# EAGLE design board (EAGLE 9.6.2)
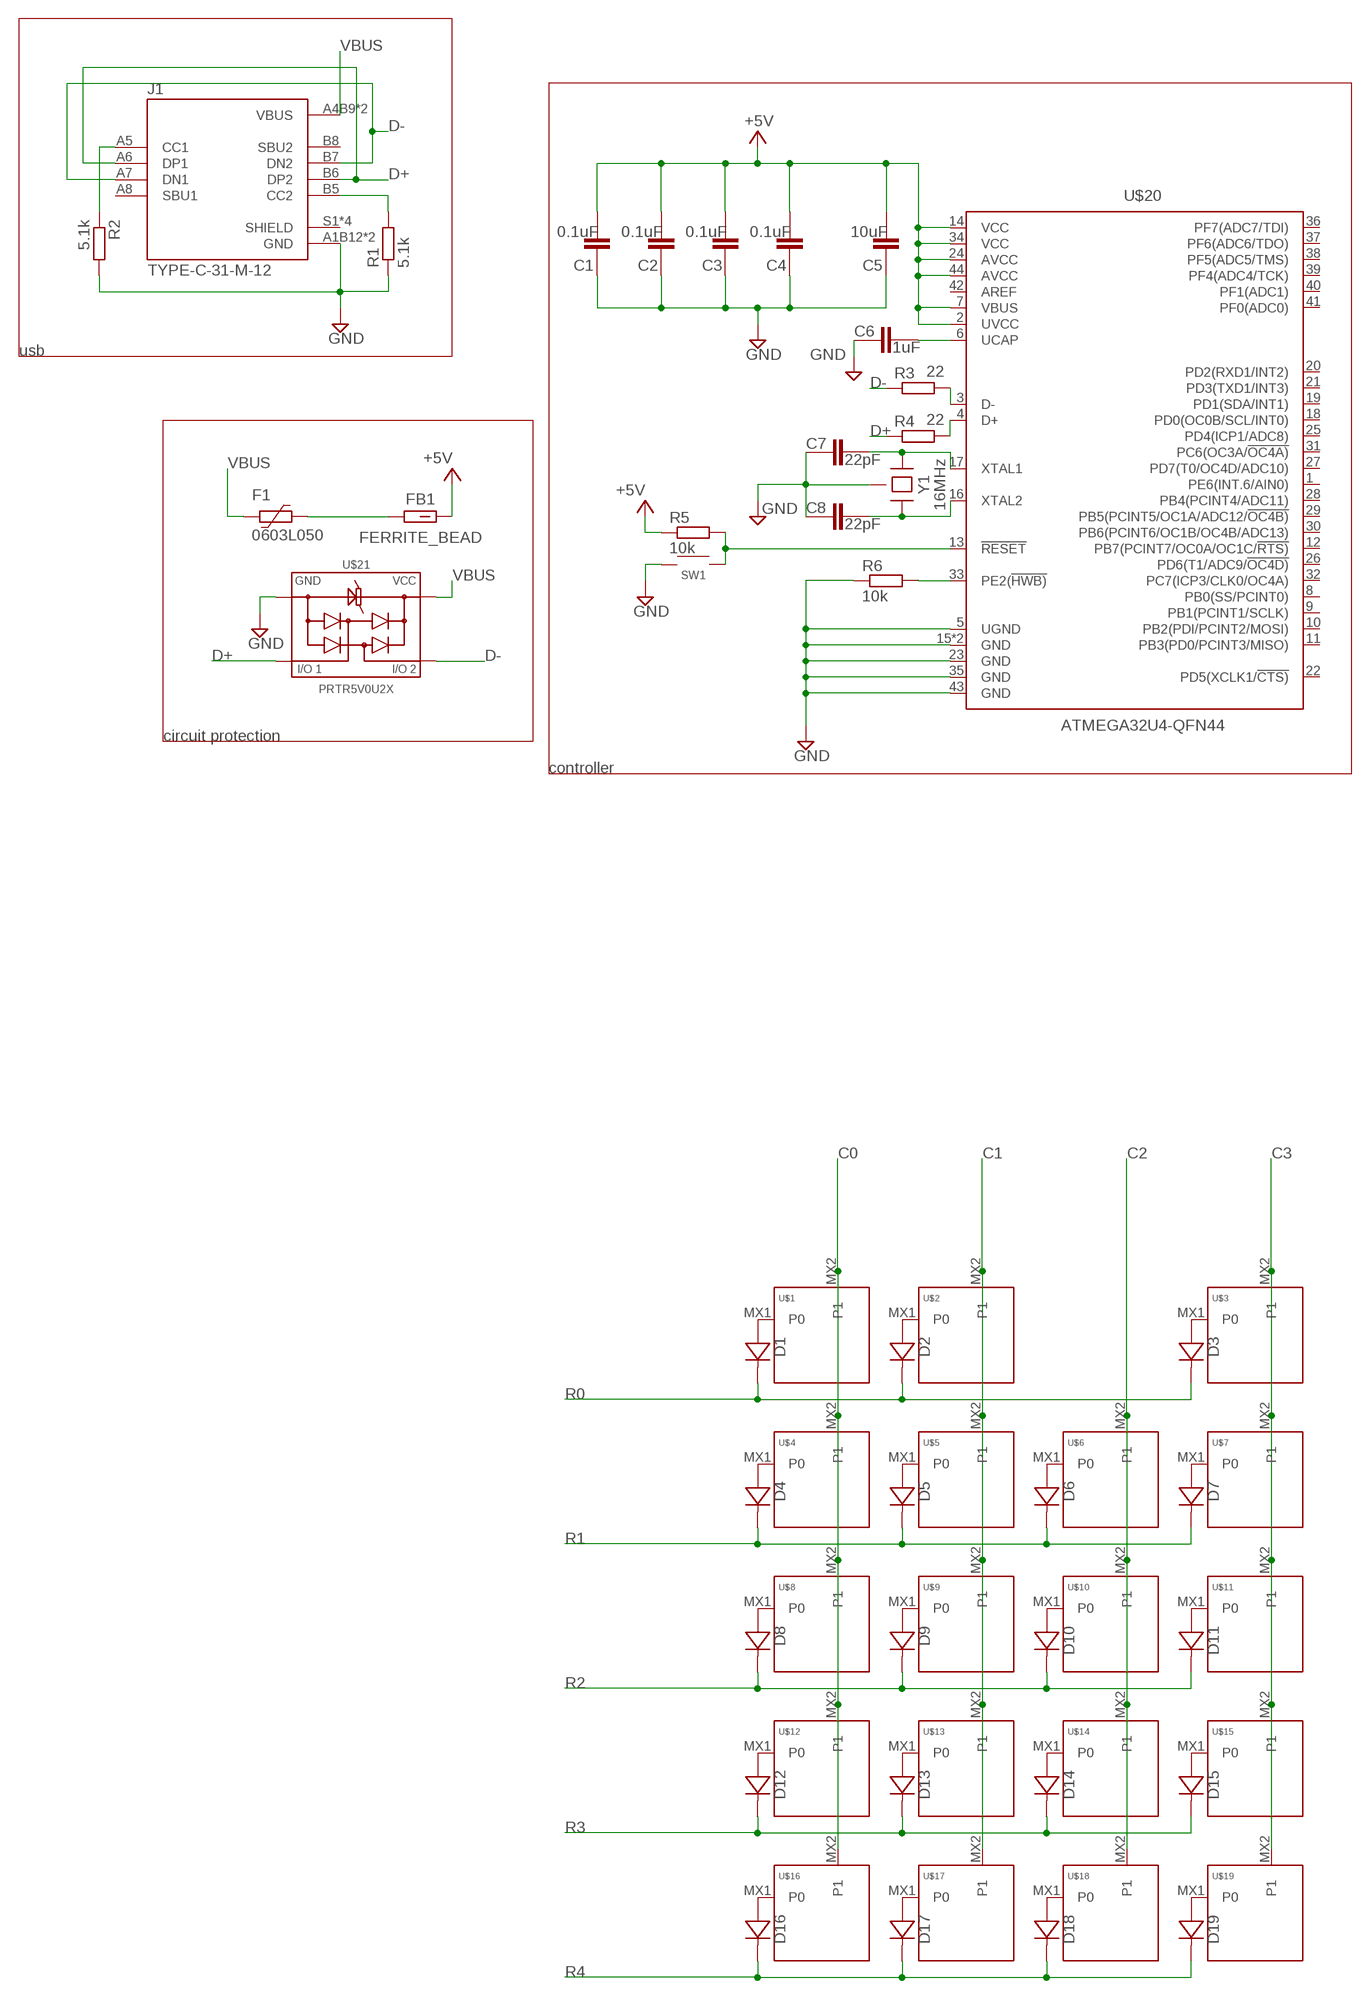
[diagram p0: schematic, sheet 1]

## Parts
C1  0.1uF  CAPACITOR-0603  [C0603]
C2  0.1uF  CAPACITOR-0603  [C0603]
C3  0.1uF  CAPACITOR-0603  [C0603]
C4  0.1uF  CAPACITOR-0603  [C0603]
C5  10uF  CAPACITOR-0603  [C0603]
C6  1uF  CAPACITOR-0603  [C0603]
C7  22pF  CAPACITOR-0603  [C0603]
C8  22pF  CAPACITOR-0603  [C0603]
D1  DIODE-SOD-123  [SOD-123]
D2  DIODE-SOD-123  [SOD-123]
D3  DIODE-SOD-123  [SOD-123]
D4  DIODE-SOD-123  [SOD-123]
D5  DIODE-SOD-123  [SOD-123]
D6  DIODE-SOD-123  [SOD-123]
D7  DIODE-SOD-123  [SOD-123]
D8  DIODE-SOD-123  [SOD-123]
D9  DIODE-SOD-123  [SOD-123]
D10  DIODE-SOD-123  [SOD-123]
D11  DIODE-SOD-123  [SOD-123]
D12  DIODE-SOD-123  [SOD-123]
D13  DIODE-SOD-123  [SOD-123]
D14  DIODE-SOD-123  [SOD-123]
D15  DIODE-SOD-123  [SOD-123]
D16  DIODE-SOD-123  [SOD-123]
D17  DIODE-SOD-123  [SOD-123]
D18  DIODE-SOD-123  [SOD-123]
D19  DIODE-SOD-123  [SOD-123]
F1  0603L050  [0603L]
FB1  FERRITE_BEAD  FBCHIP-0603(1608-METRIC)  [BEADC1608X95N]
J1  TYPE-C-31-M-12  [HRO_TYPE-C-31-M-12]
R1  5.1k  RESISTOR-0603  [R0603]
R2  5.1k  RESISTOR-0603  [R0603]
R3  22  RESISTOR-0603  [R0603]
R4  22  RESISTOR-0603  [R0603]
R5  10k  RESISTOR-0603  [R0603]
R6  10k  RESISTOR-0603  [R0603]
SW1  SWITCH-SMD-EVP-BB2A9B00  [SWITCH-SMD-EVP-BB2A9B00]
U$1  KEYSWITCH-PLAIN-MX-1U  [MX-1U]
U$2  KEYSWITCH-PLAIN-MX-2U-FLIPPED  [MX-2U-FLIPPED]
U$3  KEYSWITCH-PLAIN-MX-1U  [MX-1U]
U$4  KEYSWITCH-PLAIN-MX-1U  [MX-1U]
U$5  KEYSWITCH-PLAIN-MX-1U  [MX-1U]
U$6  KEYSWITCH-PLAIN-MX-1U  [MX-1U]
U$7  KEYSWITCH-PLAIN-MX-1U  [MX-1U]
U$8  KEYSWITCH-PLAIN-MX-1U  [MX-1U]
U$9  KEYSWITCH-PLAIN-MX-1U  [MX-1U]
U$10  KEYSWITCH-PLAIN-MX-1U  [MX-1U]
U$11  KEYSWITCH-PLAIN-MX-1U  [MX-1U]
U$12  KEYSWITCH-PLAIN-MX-1U  [MX-1U]
U$13  KEYSWITCH-PLAIN-MX-1U  [MX-1U]
U$14  KEYSWITCH-PLAIN-MX-1U  [MX-1U]
U$15  KEYSWITCH-PLAIN-MX-1U  [MX-1U]
U$16  KEYSWITCH-PLAIN-MX-1U  [MX-1U]
U$17  KEYSWITCH-PLAIN-MX-1U  [MX-1U]
U$18  KEYSWITCH-PLAIN-MX-1U  [MX-1U]
U$19  KEYSWITCH-PLAIN-MX-1U  [MX-1U]
U$20  ATMEGA32U4-QFN44  [QFN-44]
U$21  PRTR5V0U2X  [PRTR5V0U2X]
Y1  16MHz  CRYSTAL-4PIN-3.2X2.5  [CRYSTAL-3.2X2.5]

## Nets
C0: U$1.MX2(P1) U$4.MX2(P1) U$8.MX2(P1) U$12.MX2(P1) U$16.MX2(P1)
C1: U$2.MX2(P1) U$5.MX2(P1) U$9.MX2(P1) U$13.MX2(P1) U$17.MX2(P1)
C2: U$6.MX2(P1) U$10.MX2(P1) U$14.MX2(P1) U$18.MX2(P1)
C3: U$3.MX2(P1) U$7.MX2(P1) U$11.MX2(P1) U$15.MX2(P1) U$19.MX2(P1)
D+: J1.A6(DP1) J1.B6(DP2) R4.1 U$21.2
D-: J1.A7(DN1) J1.B7(DN2) R3.1 U$21.3
GND: C1.1 C2.1 C3.1 C4.1 C5.1 C6.1 C7.1 C8.1 J1.A1B12(GND) J1.B1A12(GND) R1.1 R2.2 R6.1 SW1.A@1 SW1.A@2 U$20.5(UGND) U$20.15(GND) U$20.23(GND) U$20.35(GND) U$20.43(GND) U$20.TAB(GND) U$21.1 Y1.2(GND) Y1.4(GND)
N$1: D1.A U$1.MX1(P0)
N$2: D2.A U$2.MX1(P0)
N$3: D3.A U$3.MX1(P0)
N$4: D4.A U$4.MX1(P0)
N$5: D5.A U$5.MX1(P0)
N$6: D6.A U$6.MX1(P0)
N$7: D7.A U$7.MX1(P0)
N$8: D8.A U$8.MX1(P0)
N$9: D9.A U$9.MX1(P0)
N$10: D10.A U$10.MX1(P0)
N$11: D11.A U$11.MX1(P0)
N$12: D12.A U$12.MX1(P0)
N$13: D13.A U$13.MX1(P0)
N$14: D14.A U$14.MX1(P0)
N$15: D15.A U$15.MX1(P0)
N$16: D16.A U$16.MX1(P0)
N$17: D17.A U$17.MX1(P0)
N$18: D18.A U$18.MX1(P0)
N$19: D19.A U$19.MX1(P0)
N$20: J1.A5(CC1) R2.1
N$21: C6.2 U$20.6(UCAP)
N$22: C7.2 U$20.17(XTAL1) Y1.1
N$23: J1.B5(CC2) R1.2
N$24: R3.2 U$20.3(D-)
N$25: R4.2 U$20.4(D+)
N$26: C8.2 U$20.16(XTAL2) Y1.3
N$27: R5.2 SW1.B@3 SW1.B@4 U$20.13(!RESET)
N$28: R6.2 U$20.33(PE2(!HWB))
N$29: F1.1 FB1.1
R0: D1.C D2.C D3.C
R1: D4.C D5.C D6.C D7.C
R2: D8.C D9.C D10.C D11.C
R3: D12.C D13.C D14.C D15.C
R4: D16.C D17.C D18.C D19.C
VBUS: F1.2 J1.A4B9(VBUS) J1.B4A9(VBUS) U$21.4
VCC: C1.2 C2.2 C3.2 C4.2 C5.2 FB1.2 R5.1 U$20.2(UVCC) U$20.7(VBUS) U$20.14(VCC) U$20.24(AVCC) U$20.34(VCC) U$20.44(AVCC) ; supply symbol labelled +5V
Unconnected: J1.A8(SBU1) J1.B8(SBU2) J1.S1(SHIELD) J1.S2(SHIELD) J1.S3(SHIELD) J1.S4(SHIELD) U$20.1(PE6(INT.6/AIN0)) U$20.8(PB0(SS/PCINT0)) U$20.9(PB1(PCINT1/SCLK)) U$20.10(PB2(PDI/PCINT2/MOSI)) U$20.11(PB3(PD0/PCINT3/MISO)) U$20.12(PB7(PCINT7/OC0A/OC1C/!RTS)) U$20.18(PD0(OC0B/SCL/INT0)) U$20.19(PD1(SDA/INT1)) U$20.20(PD2(RXD1/INT2)) U$20.21(PD3(TXD1/INT3)) U$20.22(PD5(XCLK1/!CTS)) U$20.25(PD4(ICP1/ADC8)) U$20.26(PD6(T1/ADC9/!OC4D)) U$20.27(PD7(T0/OC4D/ADC10)) U$20.28(PB4(PCINT4/ADC11)) U$20.29(PB5(PCINT5/OC1A/ADC12/!OC4B)) U$20.30(PB6(PCINT6/OC1B/OC4B/ADC13)) U$20.31(PC6(OC3A/!OC4A)) U$20.32(PC7(ICP3/CLK0/OC4A)) U$20.36(PF7(ADC7/TDI)) U$20.37(PF6(ADC6/TDO)) U$20.38(PF5(ADC5/TMS)) U$20.39(PF4(ADC4/TCK)) U$20.40(PF1(ADC1)) U$20.41(PF0(ADC0)) U$20.42(AREF)

## Notes on the sheet
- usb
- circuit protection
- controller

## Library data of the parts
C1-C8 = Components:CAPACITOR
D1-D19 = Components:DIODE: Standard 1N4148 diode
F1 = polyfuse-smd_20:?: Polyfuse Resettable PTC Source: http://www.littelfuse.com/products/resettable-ptcs.aspx; MF: Littelfuse; MPN: 0603L050; OC_FARNELL: 2125904; OC_NEWARK: 88T7683
FB1 = Filter:FB: Ferrite Bead - Generic; CATEGORY: Filter; SUB-CATEGORY: Ferrite bead
J1 = TYPE-C-31-M-12:TYPE-C-31-M-12: USB Connectors 24 Receptacle 1 8.94*7.3mm RoHS; AVAILABILITY: Unavailable; DESCRIPTION: USB Connectors 24 Receptacle 1 8.94*7.3mm RoHS; MF: HRO Electronics Co., Ltd.; MP: TYPE-C-31-M-12; PACKAGE: Package; PRICE: None
R1-R6 = Components:RESISTOR
SW1 = Controller:SWITCH-SMD
U$1-U$19 = Keyboard:KEYSWITCH-PLAIN
U$20 = Controller:ATMEGA32U4
U$21 = Controller:PRTR5V0U2X
Y1 = Components:CRYSTAL-4PIN

## Board
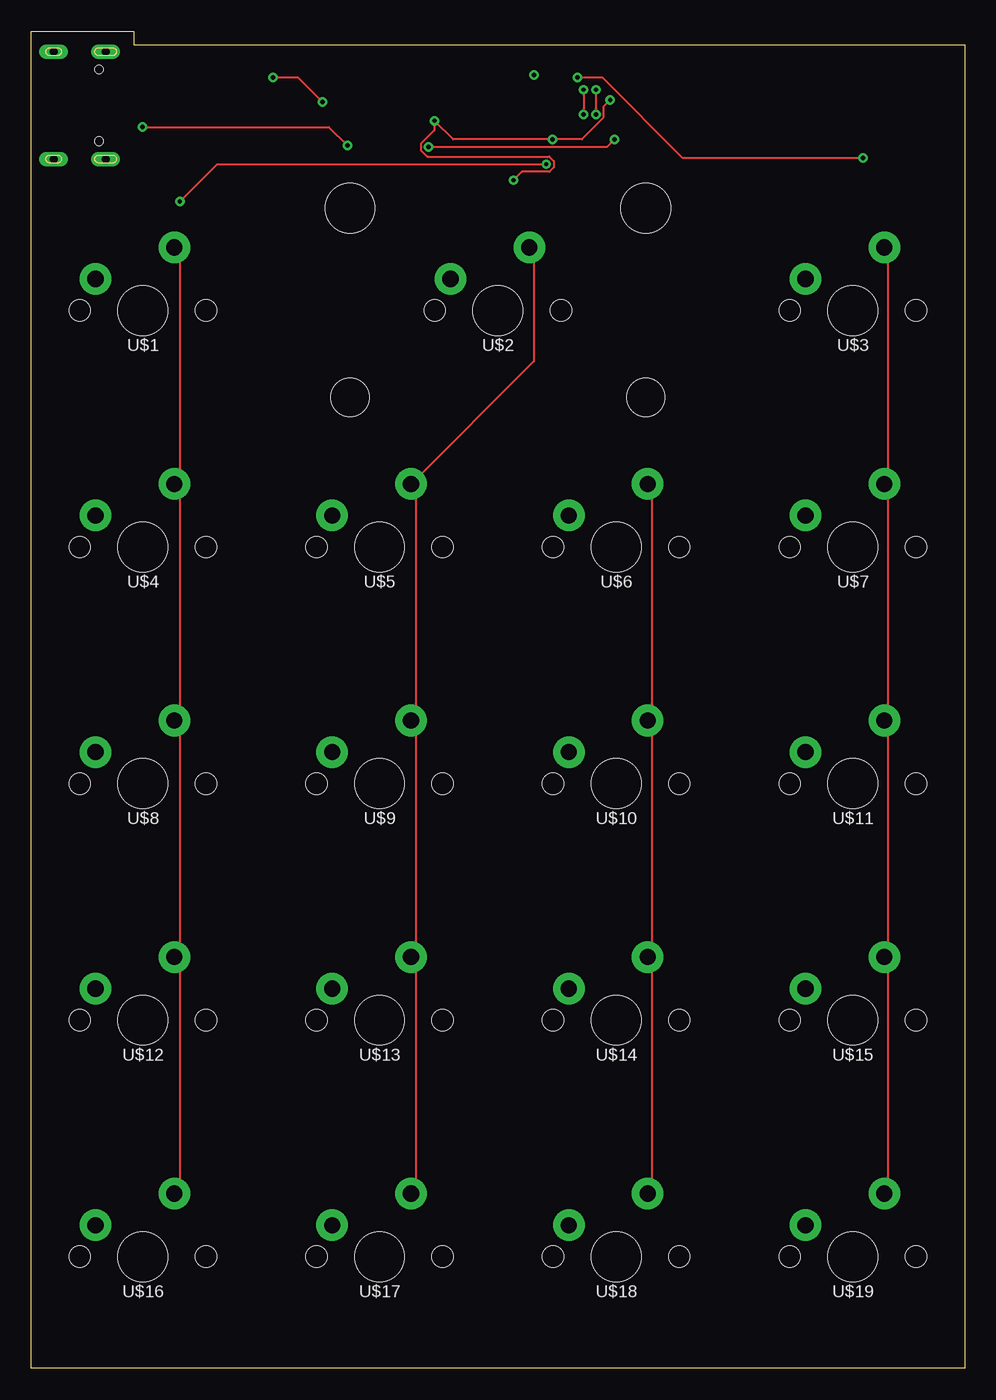
[diagram p1: board, top side]
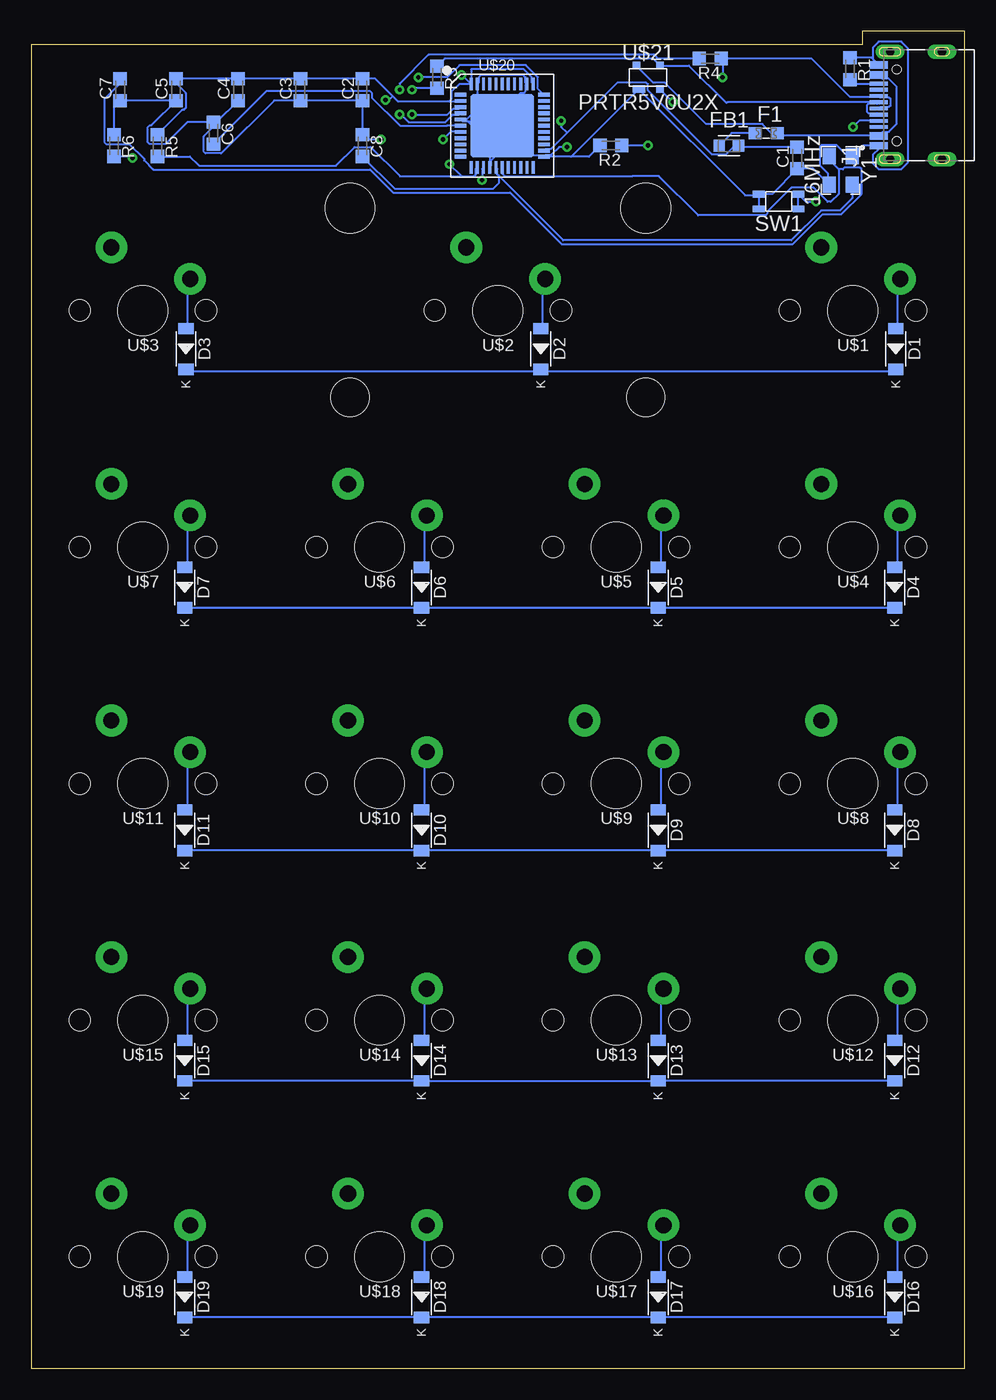
[diagram p2: board, bottom side, seen from below]

Size 75.15 x 107.7 mm. Coordinates in mm from the lower left corner, seen from the top.
Outline: 75.15,0 0,0 0,107.7 8.25,107.7 8.25,106.58 75.15,106.58 75.15,0
Copper layers (1*16): Top 0.035mm / dielectric 1.5mm / Bottom 0.035mm
Design rules "default *": minimum track width 6mil, minimum drill 0.35mm, track to track 6mil, track to pad 6mil, pad to pad 6mil, via to via 6mil, smd to smd 6mil, copper to edge 20mil, drill to drill 6mil, minimum pad ring 10mil, minimum via ring 8mil, stop-mask expansion 4mil, vias tented up to drill 0mil, thermal gap 10mil

### Footprints (pad centres in the part's own frame; a part is rotated, then mirrored left to right if it is on the bottom)
C0603 = smd 1.05 x 1.08: 1 -0.875,0; 2 0.875,0
SOD-123 = smd 0.91 x 1.22: A -1.635,0; C 1.635,0
0603L = smd 1 x 1: 1 -0.9,0; 2 0.9,0
BEADC1608X95N = smd 0.9 x 0.97: 1 -0.785,0 | smd 0.933 x 0.97: 2 0.769,0
HRO_TYPE-C-31-M-12 = smd 0.6 x 1.45: A1B12 -3.25,5.095; A4B9 -2.45,5.095; B1A12 3.25,5.095; B4A9 2.45,5.095 | smd 0.3 x 1.45: A5 -1.25,5.095; A6 -0.25,5.095; A7 0.25,5.095; A8 1.25,5.095; B5 1.75,5.095; B6 0.75,5.095; B7 -0.75,5.095; B8 -1.75,5.095 | drill 0.65 pad 1.05 long: S1 -4.32,4.18; S2 4.32,4.18; S3 -4.32,0; S4 4.32,0 | hole 0.7: -2.89,3.65; 2.89,3.65
R0603 = smd 1.05 x 1.08: 1 -0.875,0; 2 0.875,0
SWITCH-SMD-EVP-BB2A9B00 = smd 0.95 x 0.55: A@1 -1.6,0.6; A@2 -1.6,-0.6; B@3 1.6,0.6; B@4 1.6,-0.6
MX-1U = drill 1.3 pad 2.54: MX1 -3.81,2.54; MX2 2.54,5.08 | hole 4: 0,0 | hole 1.7: -5.08,0; 5.08,0
MX-2U-FLIPPED = drill 1.3 pad 2.54: MX1 -3.81,2.54; MX2 2.54,5.08 | hole 4: 0,0; -11.9,8.24; 11.9,8.24 | hole 1.7: -5.08,0; 5.08,0 | hole 3.05: -11.9,-7; 11.9,-7
QFN-44 = smd 1 x 0.3: 1 -3.35,2.5; 2 -3.35,2; 3 -3.35,1.5; 4 -3.35,1; 5 -3.35,0.5; 6 -3.35,0; 7 -3.35,-0.5; 8 -3.35,-1; 9 -3.35,-1.5; 10 -3.35,-2; 11 -3.35,-2.5; 23 3.35,-2.5; 24 3.35,-2; 25 3.35,-1.5; 26 3.35,-1; 27 3.35,-0.5; 28 3.35,0; 29 3.35,0.5; 30 3.35,1; 31 3.35,1.5; 32 3.35,2; 33 3.35,2.5 | smd 0.3 x 1: 12 -2.5,-3.35; 13 -2,-3.35; 14 -1.5,-3.35; 15 -1,-3.35; 16 -0.5,-3.35; 17 0,-3.35; 18 0.5,-3.35; 19 1,-3.35; 20 1.5,-3.35; 21 2,-3.35; 22 2.5,-3.35; 34 2.5,3.35; 35 2,3.35; 36 1.5,3.35; 37 1,3.35; 38 0.5,3.35; 39 0,3.35; 40 -0.5,3.35; 41 -1,3.35; 42 -1.5,3.35; 43 -2,3.35; 44 -2.5,3.35 | smd 5.08 x 5.08: TAB 0,0
PRTR5V0U2X = smd 1 x 0.6: 1 -0.75,-0.95 | smd 0.6 x 0.6: 2 0.95,-0.95; 3 0.95,0.95; 4 -0.95,0.95
CRYSTAL-3.2X2.5 = smd 1.3 x 1.05: 1 -1.15,-0.925; 2 1.15,-0.925; 3 1.15,0.925; 4 -1.15,0.925

### Placement (x,y rotation side)
C1  13.47,97.48 90 bottom
C2  48.48,102.98 90 bottom
C3  53.48,102.98 90 bottom
C4  58.48,102.98 90 bottom
C5  63.48,102.98 90 bottom
C6  60.48,99.48 270 bottom
C7  67.97,102.98 90 bottom
C8  48.48,98.48 270 bottom
D1  5.53,82.1 270 bottom
D2  34.11,82.1 270 bottom
D3  62.68,82.1 270 bottom
D4  5.62,62.89 270 bottom
D5  24.67,62.89 270 bottom
D6  43.72,62.89 270 bottom
D7  62.77,62.89 270 bottom
D8  5.62,43.34 270 bottom
D9  24.67,43.34 270 bottom
D10  43.72,43.34 270 bottom
D11  62.77,43.34 270 bottom
D12  5.62,24.79 270 bottom
D13  24.67,24.79 270 bottom
D14  43.72,24.79 270 bottom
D15  62.77,24.79 270 bottom
D16  5.62,5.74 270 bottom
D17  24.67,5.74 270 bottom
D18  43.72,5.74 270 bottom
D19  62.77,5.74 270 bottom
F1  15.97,99.48 0 bottom
FB1  18.98,98.48 0 bottom
J1  1.82,101.72 90 bottom
R1  9.23,104.66 270 bottom
R2  28.48,98.48 180 bottom
R3  42.48,103.98 270 bottom
R4  20.48,105.48 180 bottom
R5  64.97,98.48 270 bottom
R6  68.47,98.48 270 bottom
SW1  14.97,93.98 0 bottom
U$1  9,85.2 0 top
U$2  37.58,85.2 0 top
U$3  66.15,85.2 0 top
U$4  9,66.15 0 top
U$5  28.05,66.15 0 top
U$6  47.1,66.15 0 top
U$7  66.15,66.15 0 top
U$8  9,47.1 0 top
U$9  28.05,47.1 0 top
U$10  47.1,47.1 0 top
U$11  66.15,47.1 0 top
U$12  9,28.05 0 top
U$13  28.05,28.05 0 top
U$14  47.1,28.05 0 top
U$15  66.15,28.05 0 top
U$16  9,9 0 top
U$17  28.05,9 0 top
U$18  47.1,9 0 top
U$19  66.15,9 0 top
U$20  37.23,100.07 0 bottom
U$21  25.48,103.98 0 bottom
Y1  9.97,96.48 270 bottom

### Tracks (layer width: path | path; a pad name or v marks a point on that pad's centre or on a via)
C0
  Top 0.152: U$1.MX2 11.97,89.85 11.97,71.67 U$4.MX2 11.97,70.8 11.97,52.62 U$8.MX2 11.97,51.75 11.97,33.57 U$12.MX2 11.97,32.7 11.97,14.52 U$16.MX2
C1
  Top 0.152: U$2.MX2 40.48,89.92 40.48,81.12 U$5.MX2 30.98,70.85 30.98,52.48 30.68,52.18 U$9.MX2 30.98,51.8 30.98,33.48 30.63,33.13 U$13.MX2 30.98,32.75 30.98,14.47 U$17.MX2
C2
  Top 0.152: U$6.MX2 49.9,70.98 49.98,70.98 49.98,52.48 49.68,52.18 U$10.MX2 49.98,51.85 49.98,33.47 U$14.MX2 49.98,32.8 49.98,14.42 U$18.MX2
C3
  Top 0.152: U$3.MX2 68.97,90 68.97,71.52 U$7.MX2 68.94,70.98 68.97,70.98 68.97,52.47 U$11.MX2 68.97,51.9 68.97,33.42 U$15.MX2 68.97,32.85 68.97,14.37 U$19.MX2
D+  (via drill 0.35)
  Top 0.152: v19.48,103.98 21.48,103.98 v23.48,101.98
  Bottom 0.152: J1.A6 6.79,101.59 6.1,101.59 5.96,101.72 5.96,102.21 6.1,102.35 6.79,102.35 J1.B6 6.99,102.39 9.23,102.39 12.31,105.48 R4.1 19.48,105.35 v19.48,103.98 | U$21.2 v23.48,101.98
D-
  Bottom 0.152: R3.1 41.85,105.48 25.08,105.48 U$21.3 22.19,104.93 19.16,101.9 19.09,101.97 J1.A7 7.04,101.85 7.74,101.85 7.87,101.71 7.87,101.22 7.74,101.09 7.04,101.09 J1.B7
GND  (via drill 0.35)
  Top 0.152: v46.98,98.98 46.36,98.36 v31.99,98.36
  Bottom 0.152: R1.1 7.48,105.54 J1.B1A12 7.39,105.44 7.39,106.37 6.92,106.84 5.09,106.84 4.54,106.29 4.54,97.14 5.09,96.59 6.92,96.59 7.39,97.06 7.39,97.73 6.92,98.2 J1.A1B12 8.21,98.47 Y1.4 9.4,97.63 10.28,98.5 11.52,98.5 11.65,98.37 11.65,96.88 11.01,96.24 11.01,95.44 | Y1.2 11.01,95.44 | 11.01,95.44 12.17,96.6 C1.1 15.5,94.58 SW1.A@1 16.58,94.48 | 16.58,94.48 SW1.A@2 | 16.58,94.48 17.68,94.48 U$21.1 31.68,97.58 U$20.23 | R6.1 68.47,101.6 C7.1 C5.1 65.47,100.1 65.61,100.1 65.74,99.97 65.74,98.73 65.61,98.6 64.34,98.6 62.59,100.35 C6.1 | U$20.23 34,97.7 35.48,97.7 | 40.25,100.45 40.45,100.45 U$20.5 | 40.25,100.45 39.23,101.47 U$20.43 39.11,103.55 39.11,104 38.95,104.15 35.5,104.15 35.35,104 35.35,103.55 U$20.35 35.35,103.3 35.35,102.85 35.5,102.7 35.75,102.7 36.48,101.98 36.48,98.7 35.48,97.7 | 40.25,100.45 38.5,100.45 38.23,100.18 U$20.15 38.11,96.85 38.11,97.3 37.71,97.7 35.48,97.7 | C6.1 60.23,100.35 C4.1 | C6.1 60.48,99.99 61.24,99.22 61.24,97.98 61.11,97.85 59.84,97.85 55.59,102.1 C3.1 C2.1 C8.1 48.1,98.98 v46.98,98.98 | R2.2 30.25,97.58 U$20.23 | U$20.23 33.76,97.7 33.3,97.7 32.64,98.36 v31.99,98.36 | 40.25,100.45 40,100.45 39.62,100.08 U$20.TAB
N$1
  Bottom 0.152: D1.A 5.42,83.85 5.42,87.51 U$1.MX1
N$2
  Bottom 0.152: D2.A 33.99,83.85 33.99,87.51 U$2.MX1
N$3
  Bottom 0.152: D3.A 62.57,83.85 62.57,87.51 U$3.MX1
N$4
  Bottom 0.152: D4.A 5.42,64.73 5.42,68.46 U$4.MX1
N$5
  Bottom 0.152: D5.A 24.47,64.73 24.47,68.46 U$5.MX1
N$6
  Bottom 0.152: D6.A 43.52,64.73 43.52,68.46 U$6.MX1
N$7
  Bottom 0.152: D7.A 62.57,64.73 62.57,68.46 U$7.MX1
N$8
  Bottom 0.152: D8.A 5.42,45.18 5.42,49.41 U$8.MX1
N$9
  Bottom 0.152: D9.A 24.47,45.18 24.47,49.41 U$9.MX1
N$10
  Bottom 0.152: D10.A 43.52,45.18 43.52,49.41 U$10.MX1
N$11
  Bottom 0.152: D11.A 62.57,45.18 62.57,49.41 U$11.MX1
N$12
  Bottom 0.152: D12.A 5.42,26.63 5.42,30.36 U$12.MX1
N$13
  Bottom 0.152: D13.A 24.47,26.63 24.47,30.36 U$13.MX1
N$14
  Bottom 0.152: D14.A 43.52,26.63 43.52,30.36 U$14.MX1
N$15
  Bottom 0.152: D15.A 62.57,26.63 62.57,30.36 U$15.MX1
N$16
  Bottom 0.152: D16.A 5.42,7.58 5.42,11.31 U$16.MX1
N$17
  Bottom 0.152: D17.A 24.47,7.58 24.47,11.31 U$17.MX1
N$18
  Bottom 0.152: D18.A 43.52,7.58 43.52,11.31 U$18.MX1
N$19
  Bottom 0.152: D19.A 62.57,7.58 62.57,11.31 U$19.MX1
N$20  (via drill 0.35)
  Top 0.152: v8.97,99.98 23.98,99.98 v25.48,98.48
  Bottom 0.152: J1.A5 8.48,100.47 v8.97,99.98 | v25.48,98.48 R2.1
N$21
  Bottom 0.152: C6.2 56.22,102.85 47.84,102.85 47.71,102.72 47.71,102.35 45.42,100.06 41.68,100.06 41.66,100.08 U$20.6
N$22
  Bottom 0.152: 10.15,96.57 10.15,94.58 10.78,93.95 11.02,93.95 12.15,95.08 13.95,95.08 15.87,93.15 15.87,93.01 16.01,92.87 21.45,92.87 24.61,96.02 26.75,96.02 26.8,95.98 36.98,95.98 37.23,96.23 U$20.17 | Y1.1 10.9,97.32 10.15,96.57 | C7.2 67.97,103.49 69.24,102.22 69.24,98.73 69.11,98.6 67.24,98.6 66.05,97.41 66.05,97.29 65.3,96.54 47.85,96.54 46,94.69 36.58,94.69 32.44,90.55 13.81,90.55 11.42,92.95 9.93,92.95 8.3,94.58 8.3,96.57 8.43,96.7 9.67,96.7 9.8,96.57 10.15,96.57
N$23
  Bottom 0.152: R1.2 8.91,103.47 J1.B5
N$24  (via drill 0.35)
  Top 0.152: v44.48,102.98 v44.48,100.98
  Bottom 0.152: R3.2 44.35,103.1 v44.48,102.98 | U$20.3 40.7,101.45 41.15,101.45 41.63,100.98 v44.48,100.98
N$25  (via drill 0.35)
  Top 0.152: v45.48,102.98 v45.48,100.98
  Bottom 0.152: R4.2 24.64,105.48 24.95,105.78 43.17,105.78 45.48,103.48 v45.48,102.98 | U$20.4 40.68,100.98 41.2,100.98 41.8,100.37 44.73,100.37 45.33,100.98 v45.48,100.98
N$26
  Bottom 0.152: C8.2 45.87,95 37.95,95 37.48,95.48 37.48,96.02 | 9.05,94.91 Y1.3 9.05,94.26 10.06,93.25 11.54,93.25 13.94,90.86 32.31,90.86 37.48,96.02 | 37.48,96.02 37.61,96.15 37.61,96.6 U$20.16
N$27  (via drill 0.35)
  Top 0.152: v11.97,93.98 14.97,96.98 v41.48,96.98
  Bottom 0.152: SW1.B@4 SW1.B@3 12.78,93.98 v11.97,93.98 | 40.5,96 45.45,96 47.81,98.35 49.11,98.35 50.62,96.85 61.61,96.85 62.36,97.6 R5.2 | U$20.13 39.35,96.6 39.35,96.48 39.35,96.15 39.5,96 40.5,96 | v41.48,96.98 40.5,96
N$28  (via drill 0.35)
  Top 0.152: v66.97,97.48 52.48,97.48 45.98,103.98 v43.98,103.98
  Bottom 0.152: U$20.33 34.35,103.05 34.35,104 35.31,104.96 40.64,104.96 41.63,103.98 v43.98,103.98 | v66.97,97.48 67.1,97.6 R6.2
N$29
  Bottom 0.152: F1.1 18.76,99.48 FB1.1
R0
  Bottom 0.152: 26.55,80.31 5.68,80.31 D1.C | 24.8,80.31 33.95,80.31 D2.C 34.26,80.31 50.35,80.31 | D3.C 62.53,80.31 48.6,80.31
R1
  Bottom 0.152: D4.C D5.C D6.C D7.C
R2
  Bottom 0.152: D8.C D9.C D10.C D11.C
R3
  Bottom 0.152: D12.C D13.C D14.C D15.C
R4
  Bottom 0.152: D16.C D17.C D18.C D19.C
VBUS
  Bottom 0.152: J1.B4A9 6.59,103.85 6.1,103.85 5.46,103.21 5.46,100.22 6.1,99.59 6.59,99.59 J1.A4B9 14.87,99.27 F1.2 15.55,99.48 16.28,100.2 20.78,100.2 24.13,103.55 25.05,103.55 U$21.4
VCC  (via drill 0.35)
  Top 0.152: v38.84,95.69 39.51,96.37 41.73,96.37 42.08,96.72 42.08,97.23 41.73,97.58 31.91,97.58 31.39,98.11 31.39,98.61 32.48,99.7 v32.48,100.48 33.98,98.98 v41.98,98.98 44.33,98.98 46.08,100.72 46.08,101.61 v46.62,102.15
  Bottom 0.152: 41.48,102.05 45.64,102.05 46.02,102.43 | 41.48,102.05 40.79,102.05 40.77,102.08 U$20.2 | 46.02,102.43 47.43,103.85 C2.2 C3.2 C4.2 C5.2 63.48,103.49 62.71,102.72 62.71,101.48 62.84,101.35 62.98,101.35 R5.1 | FB1.2 18.08,98.35 C1.2 18.63,98.35 19.21,97.76 20.3,97.76 25.5,102.95 25.5,103.42 25.63,103.55 27.95,103.55 32,99.5 | U$20.24 33.76,98.2 33.3,98.2 32,99.5 | U$20.34 34.85,103.55 34.85,104 35.47,104.62 39.73,104.62 U$20.44 | 41.48,102.05 41.3,102.22 41.3,102.8 40.68,103.43 U$20.44 | U$20.44 40.45,104.15 v40.5,104.15 | U$20.7 41.38,99.58 v41.98,98.98 | U$20.14 38.84,96.62 v38.84,95.69 | v32.48,100.48 32.48,99.98 32,99.5 | 46.02,102.43 46.3,102.15 v46.62,102.15